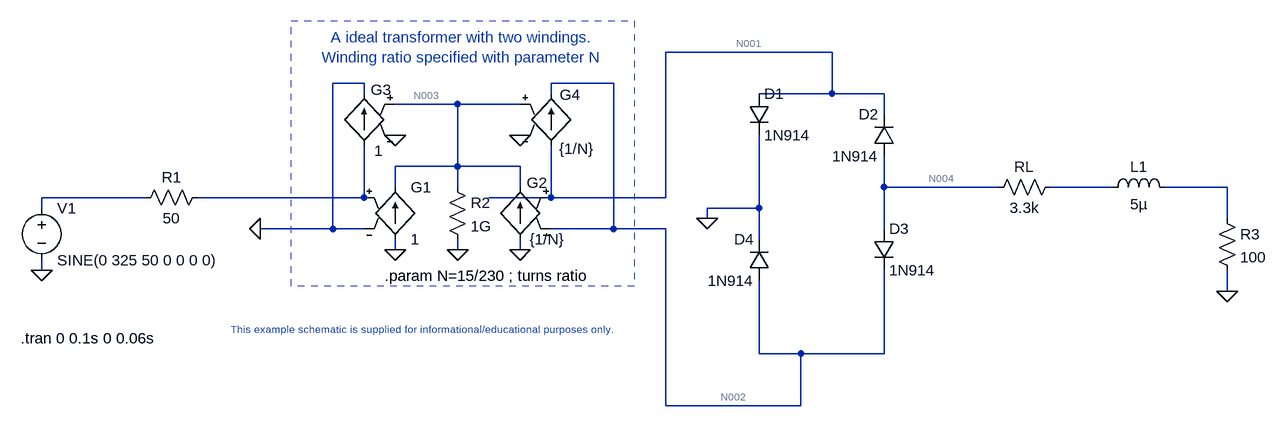
[diagram p0: schematic Series INductor_2With rectifier.asc]
Series INductor_2With rectifier.asc, the LTspice schematic file:
Version 4
SHEET 1 1972 680
WIRE 1296 -272 1040 -272
WIRE 576 -224 528 -224
WIRE 960 -224 864 -224
WIRE 576 -208 576 -224
WIRE 864 -208 864 -224
WIRE 1296 -208 1296 -272
WIRE 1296 -208 1184 -208
WIRE 1376 -208 1296 -208
WIRE 720 -192 624 -192
WIRE 816 -192 720 -192
WIRE 1376 -176 1376 -208
WIRE 720 -96 720 -192
WIRE 720 -96 624 -96
WIRE 816 -96 720 -96
WIRE 624 -64 624 -96
WIRE 720 -64 720 -96
WIRE 816 -64 816 -96
WIRE 1376 -64 1376 -112
WIRE 1552 -64 1376 -64
WIRE 1728 -64 1632 -64
WIRE 1904 -64 1808 -64
WIRE 240 -48 80 -48
WIRE 576 -48 576 -128
WIRE 576 -48 320 -48
WIRE 864 -48 864 -128
WIRE 864 -48 768 -48
WIRE 1040 -48 1040 -272
WIRE 1040 -48 864 -48
WIRE 80 -32 80 -48
WIRE 1184 -32 1184 -144
WIRE 1184 -32 1104 -32
WIRE 1104 -16 1104 -32
WIRE 1904 -16 1904 -64
WIRE 528 0 528 -224
WIRE 528 0 416 0
WIRE 576 0 528 0
WIRE 960 0 960 -224
WIRE 960 0 864 0
WIRE 1040 0 960 0
WIRE 1376 0 1376 -64
WIRE 1184 16 1184 -32
WIRE 624 32 624 16
WIRE 720 32 720 16
WIRE 816 32 816 16
WIRE 80 64 80 48
WIRE 1904 96 1904 64
WIRE 1184 192 1184 80
WIRE 1248 192 1184 192
WIRE 1376 192 1376 64
WIRE 1376 192 1248 192
WIRE 1040 272 1040 0
WIRE 1248 272 1248 192
WIRE 1248 272 1040 272
FLAG 80 64 0
FLAG 816 32 0
FLAG 624 32 0
FLAG 624 -144 0
FLAG 816 -144 0
FLAG 720 32 0
FLAG 416 0 0
FLAG 1104 -16 0
FLAG 1904 96 0
SYMBOL voltage 80 -48 R0
WINDOW 123 0 0 Left 0
WINDOW 39 0 0 Left 0
SYMATTR InstName V1
SYMATTR Value SINE(0 325 50 0 0 0 0)
SYMBOL res 336 -64 R90
WINDOW 0 0 56 VBottom 2
WINDOW 3 32 56 VTop 2
SYMATTR InstName R1
SYMATTR Value 50
SYMBOL g 624 -80 R0
SYMATTR InstName G1
SYMATTR Value 1
SYMBOL g 816 -80 M0
WINDOW 0 -10 9 Right 2
WINDOW 3 -15 96 Right 2
SYMATTR InstName G2
SYMATTR Value {1/N}
SYMBOL g 576 -224 M0
WINDOW 0 -10 10 Right 2
WINDOW 3 -16 104 Right 2
SYMATTR InstName G3
SYMATTR Value 1
SYMBOL g 864 -224 R0
WINDOW 0 13 18 Left 2
WINDOW 3 12 101 Left 2
SYMATTR InstName G4
SYMATTR Value {1/N}
SYMBOL res 704 -80 R0
SYMATTR InstName R2
SYMATTR Value 1G
SYMBOL diode 1168 -208 R0
SYMATTR InstName D1
SYMATTR Value 1N914
SYMBOL diode 1392 -112 R180
WINDOW 0 24 64 Left 2
WINDOW 3 24 0 Left 2
SYMATTR InstName D2
SYMATTR Value 1N914
SYMBOL diode 1360 0 R0
SYMATTR InstName D3
SYMATTR Value 1N914
SYMBOL diode 1200 80 R180
WINDOW 0 24 64 Left 2
WINDOW 3 24 0 Left 2
SYMATTR InstName D4
SYMATTR Value 1N914
SYMBOL res 1536 -48 R270
WINDOW 0 32 56 VTop 2
WINDOW 3 0 56 VBottom 2
SYMATTR InstName RL
SYMATTR Value 3.3k
SYMBOL ind 1712 -48 R270
WINDOW 0 32 56 VTop 2
WINDOW 3 5 56 VBottom 2
SYMATTR InstName L1
SYMATTR Value 5µ
SYMBOL res 1888 -32 R0
SYMATTR InstName R3
SYMATTR Value 100
TEXT 656 144 Top 1 ;This example schematic is supplied for informational/educational purposes only.
TEXT 728 -248 Bottom 2 ;A ideal transformer with two windings.\nWinding ratio specified with parameter N
TEXT 608 72 Left 2 !.param N=15/230 ; turns ratio
TEXT 48 168 Left 2 !.tran 0 0.1s 0 0.06s
RECTANGLE Normal 992 88 464 -320 2

The netlist it stands for:
* Series INductor_2With rectifier.asc
V1 N007 0 SINE(0 325 50 0 0 0 0)
R1 N008 N007 50
G1 0 N003 N008 0 1
G2 0 N003 N001 N002 {1/N}
G3 N008 0 N003 0 1
G4 N001 N002 N003 0 {1/N}
R2 N003 0 1G
D1 N001 0 1N914
D2 N004 N001 1N914
D3 N004 N002 1N914
D4 N002 0 1N914
RL N004 N005 3.3k
L1 N005 N006 5µ
R3 N006 0 100
.model D D
.lib standard.dio
* This example schematic is supplied for informational/educational purposes only.
* A ideal transformer with two windings.
* Winding ratio specified with parameter N
.param N=15/230 ; turns ratio
.tran 0 0.1s 0 0.06s
.backanno
.end

* Results of the author's LTspice run, read from the files saved beside the schematic
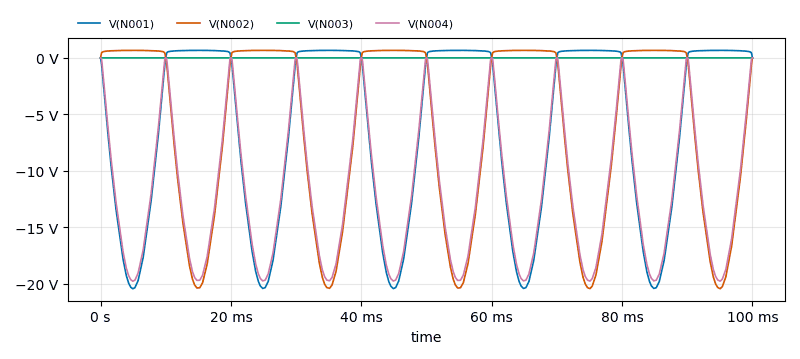
[diagram p1: Transient Analysis of Series INductor_2With rectifier.asc, plotted from the saved traces]
* Transient Analysis, 1 run:
*   V(N001): min -20.47 V, max 667.3 mV, average -6.009 V, rms 10.06 V, last 0 V
*   V(N002): min -20.46 V, max 667.3 mV, average -5.997 V, rms 10.05 V, last 0 V
*   V(N003): min -379.7 µV, max 379.8 µV, average 212.7 nV, rms 261.5 µV, last 1.704 nV
*   V(N004): min -19.8 V, max 0 V, average -12.01 V, rms 13.63 V, last 0 V